# EAGLE design Garten (EAGLE 9.5.0)
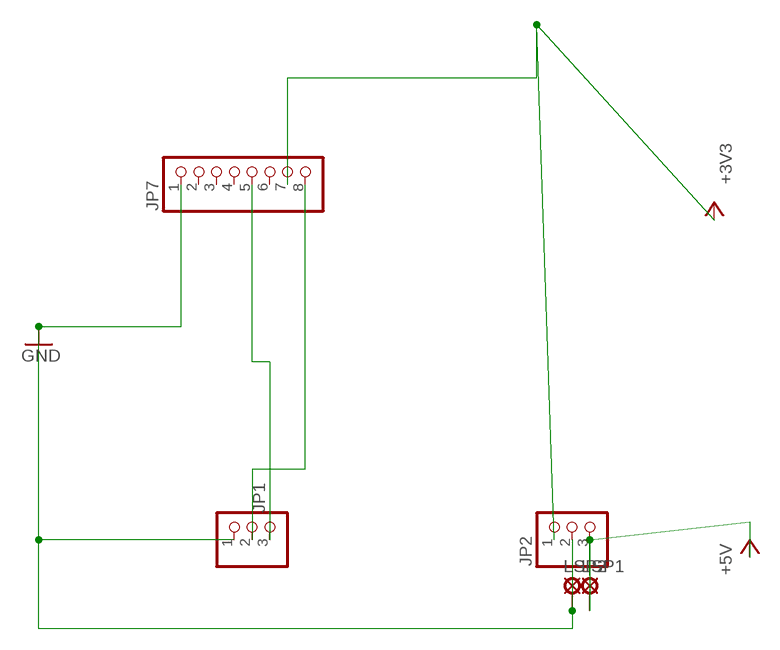
[diagram p0: schematic, sheet 1]

## Parts
JP1  PINHD-1X3/90  [1X03/90]
JP2  PINHD-1X3/90  [1X03/90]
JP7  PINHD-1X8  [1X08]
LSP1  SE11  [SE11]
LSP2  SE11  [SE11]

## Nets
+3V3: JP2.1 JP7.7
+5V: JP2.3 LSP1.MP
GND: JP1.1 JP2.2 JP7.1 LSP2.MP
SENSOR+: JP1.2 JP7.8
SENSOR_SIG: JP1.3 JP7.5
Unconnected: JP7.2 JP7.3 JP7.4 JP7.6

## Library data of the parts
JP1 JP2 = pinhead:PINHD-1X3: PIN HEADER
JP7 = pinhead:PINHD-1X8: PIN HEADER
LSP1 LSP2 = solpad:SE11: SOLDER PAD RTM, drill 1,1mm, distributor Buerklin, 07F810

## Net classes
0 default: clearance 0.205 mm

## Board
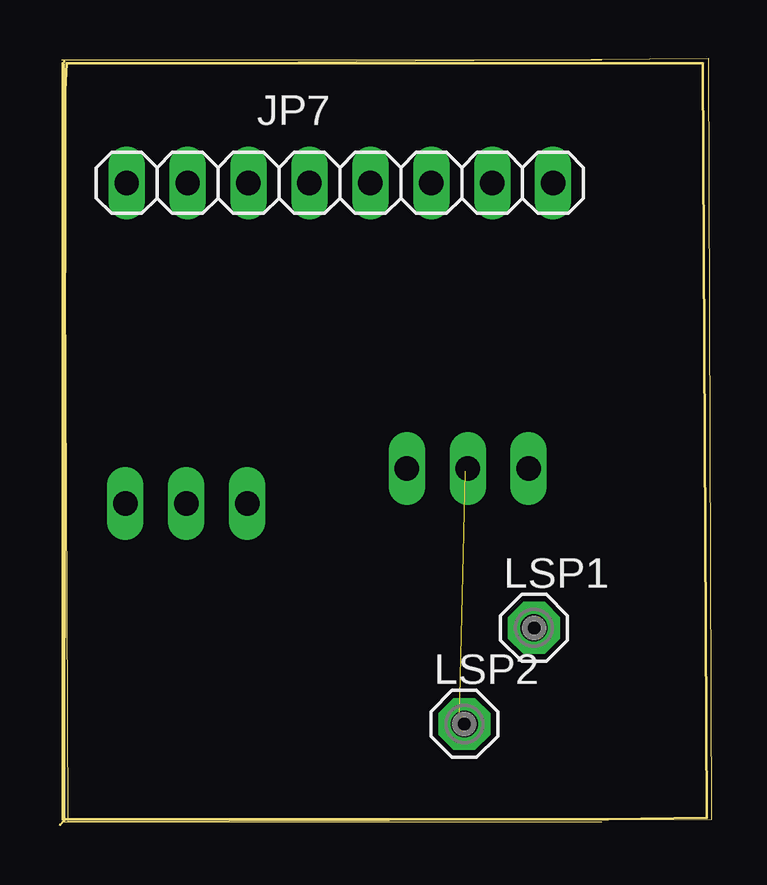
[diagram p1: board, top side]
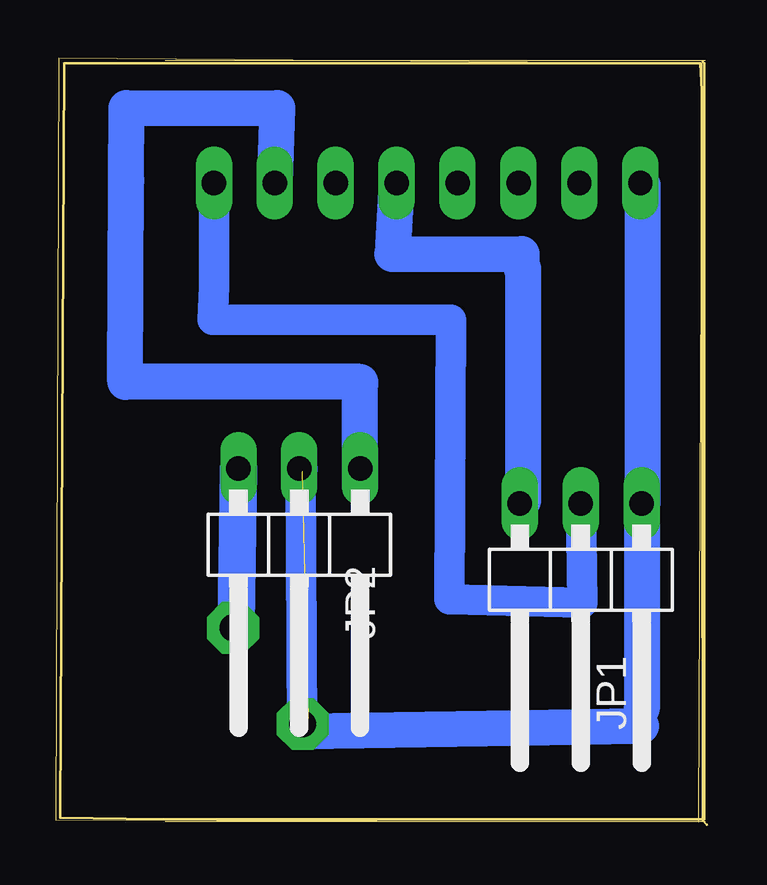
[diagram p2: board, bottom side, seen from below]

Size 26.98 x 31.86 mm. Coordinates in mm from the lower left corner, seen from the top.
Outline: 0.07,0.12 22.6,0.12
Outline: 22.6,31.86 0.07,31.86
Outline: 0.17,31.78 0.11,31.72 0.11,0.23 22.84,0.23 26.98,0.29 26.81,31.72 0.28,31.72 0.21,30.57 0.17,0.17 0,0
Copper layers (1*16): Top 0.035mm / dielectric 1.5mm / Bottom 0.035mm
Design rules "default *": minimum track width 12mil, minimum drill 24mil, track to track 25mil, track to pad 25mil, pad to pad 25mil, via to via 25mil, smd to smd 25mil, copper to edge 40mil, drill to drill 6mil, minimum pad ring 10mil, minimum via ring 8mil, stop-mask expansion 4mil, vias tented up to drill 0mil, thermal gap 10mil
Milling: 4 lines

### Footprints (pad centres in the part's own frame; a part is rotated, then mirrored left to right if it is on the bottom)
1X03/90 = drill 1.016 long: 1 -2.54,-3.81; 2 0,-3.81; 3 2.54,-3.81
1X08 = drill 1.016 long: 1 -8.89,0; 2 -6.35,0; 3 -3.81,0; 4 -1.27,0; 5 1.27,0; 6 3.81,0; 7 6.35,0; 8 8.89,0
SE11 = drill 1.118 pad 2.159 octagon: MP 0,0

### Placement (x,y rotation side)
JP1  5.27,9.56 180 bottom
JP2  17,11.02 180 bottom
JP7  11.67,26.73 0 top
LSP1  19.77,8.19 0 top
LSP2  16.86,4.19 0 top

### Tracks (layer width: path | path; a pad name or v marks a point on that pad's centre or on a via)
+3V3
  Bottom 0.813: 14.47,18.45 14.46,18.33
  Bottom 1.5: 24.21,26.84 24.26,18.45 14.47,18.45 | 24.21,26.84 | 24.21,26.84 24.2,29.86 17.93,29.85 JP7.7 | JP2.1 14.46,18.33
+5V
  Bottom 0.813: 19.64,8.32 LSP1.MP
  Bottom 1.57: 19.64,8.32 JP2.3
GND  (1 unrouted)
  Top 1.016: JP2.2 16.89,14.72
  Bottom 0.305: JP2.2 16.95,14.78
  Bottom 0.813: 2.74,4.1 2.73,4.81
  Bottom 1.213: JP7.1 2.69,26.65 | JP1.1 2.69,13.4
  Bottom 1.27: LSP2.MP 16.63,4.42 | 16.95,14.78 16.88,3.88
  Bottom 1.5: 2.74,4.1 16.88,3.88 | 16.98,14.81 JP2.2 | 2.69,26.65 2.69,13.4 | JP1.1 2.73,4.81
SENSOR+
  Bottom 1.27: JP1.2 5.2,9.24 10.73,9.39 10.67,21.03 20.61,21.03 20.56,22.42 JP7.8
SENSOR_SIG
  Bottom 1.5: JP1.3 7.68,13.5 7.68,23.17 7.72,23.17 7.72,23.77 13.12,23.78 JP7.5